# Altium project stabilizer_current_sense.PrjPCB (part 1 of 2)
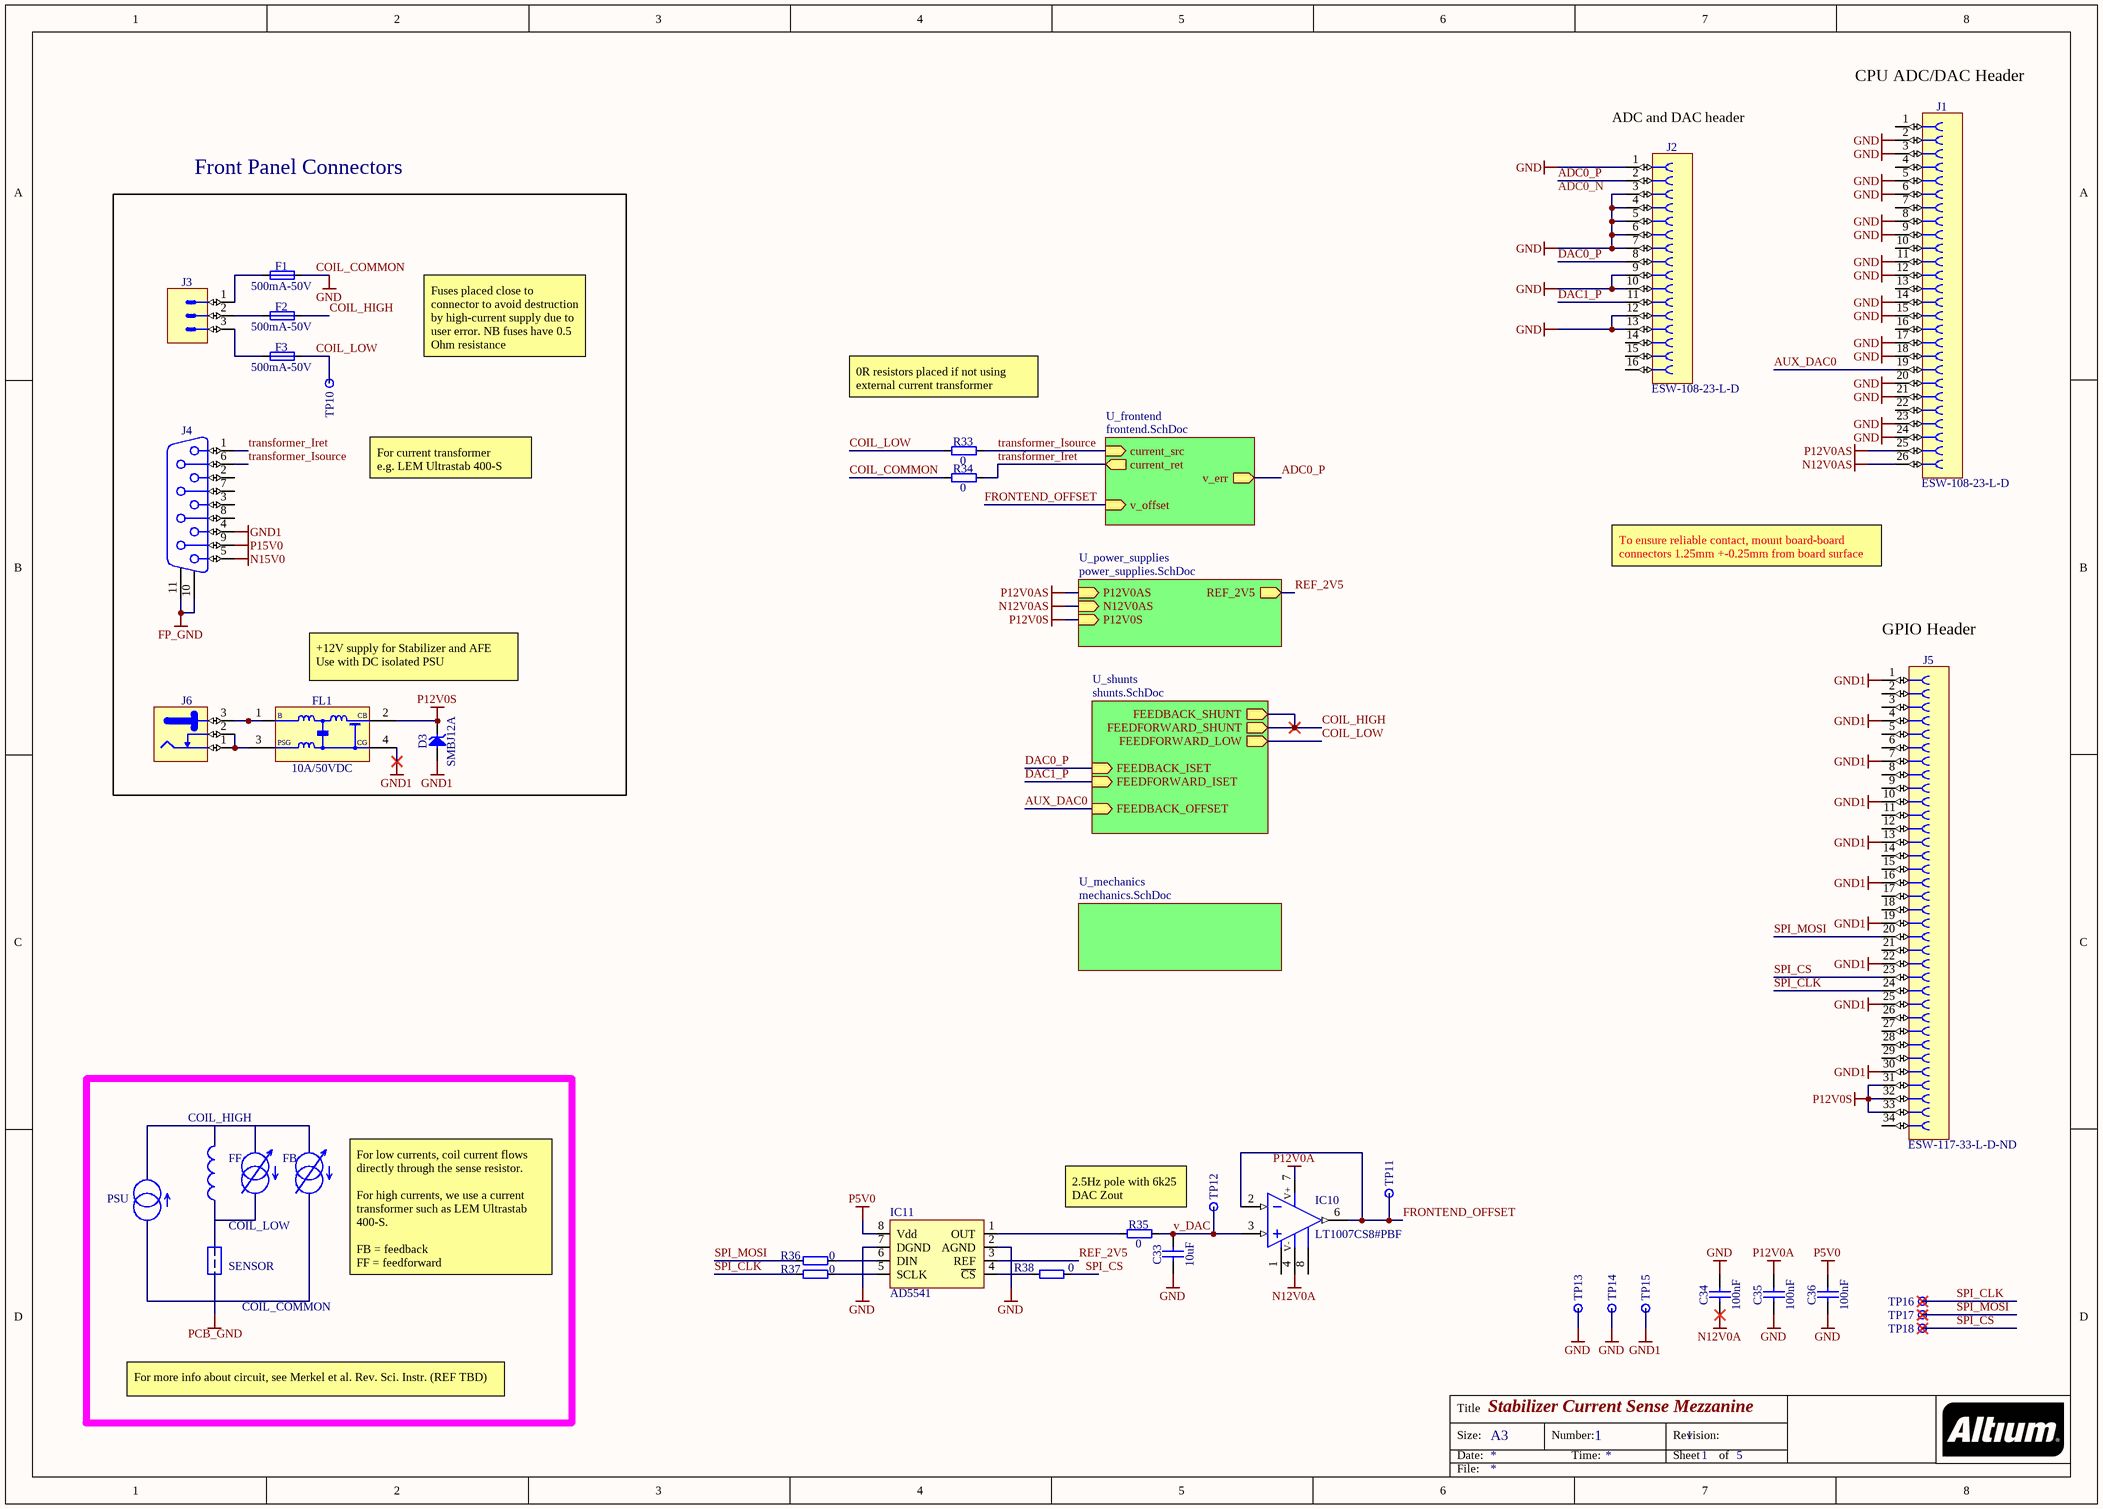
[diagram p0: stabilizer_current_sense.SchDoc]
ProjAddress1: Department of Physics; ProjAddress2: University of Oxford; ProjAddress3: UK; ProjOrganization: Ion Trapping Group; ProjRevision: 1.0
5 sheets, 206 parts. Net scope: hierarchical (ports join the sheet entries above them; power ports are global).
Board file: stabilizer_current_sense.PcbDoc
Sheets:
  stabilizer_current_sense.SchDoc
    U_power_supplies = power_supplies.SchDoc
    U_mechanics = mechanics.SchDoc
    U_frontend = frontend.SchDoc
    U_shunts = shunts.SchDoc

## Sheet stabilizer_current_sense.SchDoc: Stabilizer Current Sense Mezzanine
size A3; Organization: Ion Trapping Group; Address1: Department of Physics; Address2: University of Oxford; Address3: UK; DocumentNumber: 1; Revision: 1.0; SheetNumber: 1; SheetTotal: 5

### Parts
C33  10uF  [CAPC2012X95N]
C34  100nF  [CAPC1608X87N]
C35  100nF  [CAPC1608X87N]
C36  100nF  [CAPC1608X87N]
D3  SMBJ12A  [DIOM5336X265N]
F1  500mA-50V  [FUSC1608X55N]
F2  500mA-50V  [FUSC1608X55N]
F3  500mA-50V  [FUSC1608X55N]
FL1  10A/50VDC  [FIL_MURATA_BNX02]
IC10  LT1007CS8#PBF  [SOIC127P600X175-8N]
IC11  AD5541  [so-8]
J1  ESW-108-23-L-D  [ESW-113-23-L-D]
J2  ESW-108-23-L-D  [ESW-108-23-L-D]
J3  MSTBA  [PHOENIX_1757255]  (value not drawn)
J4  D-Sub 9F  [FCI_D09S13A4GV00LF]  (value not drawn)
J5  Manufacturer Part Number: ESW-117-33-L-D-ND  [ESW-117-23-L-D]  (hidden comment: ESW-108-23-L-D)
J6  Jack  [SWITCHCRAFT_L712RA]  (value not drawn)
R33  0  [RESC1608X55N]
R34  0  [RESC1608X55N]
R35  0  [RESC1608X55N]
R36  0  [RESC1608X55N]
R37  0  [RESC1608X55N]
R38  0  [RESC1608X55N]
TP10  Test Point  [TPS127]  (value not drawn)
TP11  Test Point  [TPS127]  (value not drawn)
TP12  Test Point  [TPS127]  (value not drawn)
TP13  Test Point  [TPS127]  (value not drawn)
TP14  Test Point  [TPS127]  (value not drawn)
TP15  Test Point  [TPS127]  (value not drawn)
TP16  Test Point  [TPS127]  (value not drawn)
TP17  Test Point  [TPS127]  (value not drawn)
TP18  Test Point  [TPS127]  (value not drawn)

### Blocks framed on the sheet
Front Panel Connectors: D3 F1-F3 FL1 J3 J4 J6 TP10

### Sub-sheets
U_frontend = frontend.SchDoc: current_src (in), current_ret (out), v_err (out), v_offset (in)
U_mechanics = mechanics.SchDoc: no entries
U_power_supplies = power_supplies.SchDoc: REF_2V5 (out), P12V0AS (in), N12V0AS (in), P12V0S (in)
U_shunts = shunts.SchDoc: FEEDBACK_OFFSET (in), FEEDBACK_ISET (in), FEEDFORWARD_ISET (in), FEEDBACK_SHUNT (out), FEEDFORWARD_SHUNT (out), FEEDFORWARD_LOW (out)

### Nets
COIL_COMMON: C33.1 C34.2 C35.1 C36.1 F1.1 IC11.2(AGND) IC11.7(DGND) J1.2 J1.3 J1.5 J1.6 J1.8 J1.9 J1.11 J1.12 J1.14 J1.15 J1.17 J1.18 J1.20 J1.21 J1.23 J1.24 J2.1 J2.3 J2.4 J2.5 J2.6 J2.7 J2.9 J2.10 J2.12 J2.13 R34.1 TP13.1 TP14.1  [also labelled GND]
FP_GND: J4.10 J4.11
GND1: D3.2(A) FL1.4(CG) J4.4 J5.1 J5.4 J5.7 J5.10 J5.13 J5.16 J5.19 J5.22 J5.25 J5.30 TP15.1
N12V0A: C34.1 IC10.4(V-)
N12V0AS: J1.26 ; sheet U_power_supplies/N12V0AS
N15V0: J4.5
P5V0: C36.2 IC11.8(Vdd)
P12V0A: C35.2 IC10.7(V+)
P12V0AS: J1.25 ; sheet U_power_supplies/P12V0AS
P12V0S: D3.1(C) FL1.2(CB) J5.31 J5.32 J5.33 ; sheet U_power_supplies/P12V0S
P15V0: J4.9
ADC0_P: J2.2 ; sheet U_frontend/v_err
AUX_DAC0: J1.19 ; sheet U_shunts/FEEDBACK_OFFSET
COIL_HIGH: F2.1 ; sheet U_shunts/FEEDBACK_SHUNT, sheet U_shunts/FEEDFORWARD_SHUNT
COIL_LOW: F3.1 R33.1 TP10.1 ; sheet U_shunts/FEEDFORWARD_LOW
DAC0_P: J2.8 ; sheet U_shunts/FEEDBACK_ISET
DAC1_P: J2.11 ; sheet U_shunts/FEEDFORWARD_ISET
FRONTEND_OFFSET: IC10.2(IN-) IC10.6(OUT) TP11.1 ; sheet U_frontend/v_offset
REF_2V5: IC11.3(REF) ; sheet U_power_supplies/REF_2V5
SPI_CLK: J5.24 R37.1 TP16.1
SPI_CS: J5.23 R38.2 TP18.1
SPI_MOSI: J5.20 R36.1 TP17.1
transformer_Iret: J4.1 R34.2 ; sheet U_frontend/current_ret
transformer_Isource: J4.6 R33.2 ; sheet U_frontend/current_src
v_DAC: C33.2 IC10.3(IN+) R35.2 TP12.1
NetF1_2: F1.2 J3.1
NetF2_2: F2.2 J3.2
NetF3_2: F3.2 J3.3
NetFL1_1: FL1.1(B) J6.3
NetFL1_3: FL1.3(PSG) J6.1 J6.2
NetIC11_1: IC11.1(OUT) R35.1
NetIC11_4: IC11.4(~{CS}) R38.1
NetIC11_5: IC11.5(SCLK) R37.2
NetIC11_6: IC11.6(DIN) R36.2

Not connected (* = marked no-connect by the designer): IC10 1(OFFSET) 8(OFFSET); J1 1 4 7 10 13 16 22; J2 14 15 16; J4 2 3 7 8; J5 2 3 5 6 8 9 11 12 14 15 17 18 21 26 27 28 29 34

### Notes on the sheet
- (near J1) CPU ADC/DAC Header
- (near J2) ADC and DAC header
- ADC0_N
- Fuses placed close to connector to avoid destruction by high-current supply due to user error. NB fuses have 0.5 Ohm resistance
- 0R resistors placed if not using external current transformer
- For current transformer
  e.g. LEM Ultrastab 400-S
- To ensure reliable contact, mount board-board connectors 1.25mm +-0.25mm from board surface
- (near J5) GPIO Header
- +12V supply for Stabilizer and AFE
  Use with DC isolated PSU
- COIL_HIGH
- FF
- FB
- PSU
- COIL_LOW
- 2.5Hz pole with 6k25 DAC Zout
- SENSOR
- COIL_COMMON
- For low currents, coil current flows directly through the sense resistor.
  For high currents, we use a current transformer such as LEM Ultrastab 400-S.
  FB = feedback
  FF = feedforward
- For more info about circuit, see Merkel et al. Rev. Sci. Instr. (REF TBD)
- PCB_GND
- Title
- Size:
- Date:
- A3
- Number:
- Time:
- Revision:
- Sheet
- of
- File:

### Library data of the parts
C33 = CC0805_10UF_25V_10%_X5R: Non-polarised capacitor; Part Description: SMD Multilayer Chip Ceramic Capacitor; Manufacturer: GENERIC; Manufacturer1 Part Number: GRM219R61E106KA12D; Voltage: 25V; TC: X5R; Tolerance: ±10%; Part Number: CC0805_10UF_25V_10%_X5R; Component Kind: Standard; Component Type: Standard; Pin Count: 2; Value: 10uF; Status: Preferred; Manufacturer Part Number: CC0805_10UF_25V_10%_X5R; Case: 0805; Mounted: Yes; Socket: No; SMD: Yes; Sense: No; Manufacturer1 Example: MURATA; Manufacturer1 ComponentHeight: 0.95mm; HelpURL: \\cern.ch\dfs\Applications\Altium\Datasheets\CC0805_X5R_MURATA_GRM.pdf; Author: CERN DEM JLC; CreateDate: 25/10/2012; LatestRevisionDate: 06/09/2016
C34-C36 = CC0603_100NF_50V_10%_X7R: Non-polarised capacitor; Part Description: SMD Multilayer Chip Ceramic Capacitor; Manufacturer: GENERIC; Manufacturer1 Part Number: 223858615649; Voltage: 50V; TC: X7R; Tolerance: ±10%; Part Number: CC0603_100NF_50V_10%_X7R; Component Kind: Standard; Component Type: Standard; Pin Count: 2; Value: 100nF; Status: Preferred; Manufacturer Part Number: CC0603_100NF_50V_10%_X7R; Case: 0603; Mounted: Yes; Socket: No; SMD: Yes; Sense: No; Manufacturer1 Example: PHYCOMP; Manufacturer1 ComponentHeight: 0.87mm; HelpURL: \\cern.ch\dfs\Applications\Altium\Datasheets\CC0603_X7R_PHYCOMP.pdf; Author: CERN DEM JLC; CreateDate: 03/12/2007; LatestRevisionDate: 03/12/2007
D3 = SMBJ12A: Zener Diode; Part Description: Uni-Directional Transient Voltage Suppressor Diode; Manufacturer: FAIRCHILD SEMICONDUCTOR; Voltage: 12V; Power: 600W; PressFit: No; Bonding: No; Part Number: SMBJ12A; Component Kind: Standard; Component Type: Standard; Device: SMBJ12A; PackageDescription: DO-214-AA/SMB Diode, Molded Body; 5.34mm L X 3.625mm W X 2.65mm H, IPC Medium Density; Manufacturer Part Number: SMBJ12A; Pin Count: 2; Case: DO-214AA; Mounted: Yes; Socket: No; SMD: Yes; Sense: No; ComponentHeight: 2.65mm; HelpURL: \\cern.ch\dfs\Applications\Altium\Datasheets\SMBJ.pdf; Author: CERN DEM JLC; CreateDate: 10/04/2013; LatestRevisionDate: 10/04/2013
F1-F3 = FUS0603_BOURNS-SF-0603F050-2: Fuse; Part Description: Thin Film Chip Fuse; Manufacturer: BOURNS; PressFit: No; Part Number: FUS0603_BOURNS-SF-0603F050-2; Component Kind: Standard; Component Type: Standard; Pin Count: 2; PackageDescription: Chip Fuse, 2-Leads, Body 1.6mm x 0.8mm, IPC Medium Density; Family: Fuse; Mounted: Yes; Socket: No; SMD: Yes; Sense: No; Value: 500mA-50V; Manufacturer Part Number: SF-0603F050-2; ComponentHeight: 0.55mm; HelpURL: \\cern.ch\dfs\Applications\Altium\Datasheets\FUSE_BOURNS_SF-0603F.pdf; Author: CERN DEM JLC; CreateDate: 01/02/2017; LatestRevisionDate: 01/02/2017
FL1 = FIL_MURATA_BNX022-01L: Block Type EMIFIL (LC Combined); Part Description: Block Type EMIFIL (LC Combined) SMD Type, BNX02* Series; Manufacturer: MURATA; Resistance: 0.5R; Part Number: FIL_MURATA_BNX022-01L; Component Kind: Standard; Component Type: Standard; Pin Count: 2; Value: 10A/50VDC; Status: None; Manufacturer Part Number: BNX022-01L; Mounted: Yes; Socket: No; SMD: Yes; Sense: No; ComponentHeight: 3.3mm; HelpURL: \\cern.ch\dfs\Applications\Altium\Datasheets\FIL_MURATA_BNX022-01L.pdf; Author: CERN DEM JLC; CreateDate: 10/10/2012; LatestRevisionDate: 10/10/2012
IC10 = LT1007CS8#PBF: Operational Amplifier with Offset 1-8; Part Description: Low Noise, High Speed Precision Operational Amplifier; Manufacturer: LINEAR TECHNOLOGY; PressFit: No; Bonding: No; Part Number: LT1007CS8#PBF; Component Kind: Standard; Component Type: Standard; Device: LT1007CS8#PBF; PackageDescription: SOIC 8, Pitch 1.27mm - Body 4x5mm, IPC Medium Density; Manufacturer Part Number: LT1007CS8#PBF; Pin Count: 7; Case: SOIC8; Mounted: Yes; Socket: No; SMD: Yes; Sense: No; ComponentHeight: 1.75mm; Author: CERN DEM JLC; HelpURL: \\cern.ch\dfs\Applications\Altium\Datasheets\LT1007CS8#PBF.pdf; CreateDate: 09/03/2011; LatestRevisionDate: 09/03/2011
IC11 = AD5541LRZ: 16 bit serial DAC; Manufacturer: ANALOG DEVICES; Manufacturer Part Number: AD5541LRZ
J1 = ESW-113-23-L-D: Connector Elevated Socket 26 POS 2.54mm, 13.59mm height; Manufacturer: Samtec; Manufacturer Part Number: ESW-108-23-L-D
J2 = ESW-108-23-L-D: Connector Elevated Socket 16 POS 2.54mm, 13.59mm height; Manufacturer: Samtec; Manufacturer Part Number: ESW-108-23-L-D
J3 = PHOENIX_1757255: Connector 3 Male; Part Description: 12A, 250V, Pitch 5.08mm, 3 Positions Header; Manufacturer: PHOENIX CONTACT; Manufacturer Part Number: 1757255 (MSTBA 2,5/ 3-G-5,08); PressFit: No; Part Number: PHOENIX_1757255; Component Kind: Standard; Component Type: Standard; Pin Count: 3; Mounted: Yes; Socket: No; SMD: No; Sense: No; Status: None; ComponentHeight: 8.6mm; HelpURL: \\cern.ch\dfs\Applications\Altium\Datasheets\PHOENIX_1757255.pdf; Author: CERN DEM JLC; CreateDate: 10/02/2010; LatestRevisionDate: 26/04/2010; Family: MSTBA
J4 = FCI_D09S13A4GV00LF: Connector D-sub 9 Female; Part Description: Right Angled D-SUB 9 Female Contacts for PCB  with Harpoons and Female Screwlock (UNC4-40) and Elec. Continuity; Manufacturer: FCI; PressFit: No; Part Number: FCI_D09S13A4GV00LF; Component Kind: Standard; Component Type: Standard; Pin Count: 11; Family: D-Sub 9F; Mounted: Yes; Socket: No; SMD: No; Sense: No; Status: None; Manufacturer Part Number: D09S13A4GV00LF; ComponentHeight: 13.86mm; HelpURL: \\cern.ch\dfs\Applications\Altium\Datasheets\FCI_D09S13A4GV00LF.pdf; Author: CERN DEM JLC; CreateDate: 04/10/2017; LatestRevisionDate: 04/10/2017
J5 = ESW-117-23-L-D: Connector Elevated Socket 34 POS 2.54mm, 13.59mm height; Manufacturer: Samtec
J6 = SWITCHCRAFT_L712RA: 24V /3. 5A, 2.1mm Diameter Pin, SMD DC Power Supply Connector With  Break Contact; Part Description: 12V/5A, 2.5mm Diameter Pin, THT DC Power Supply Connector With  Break Contact; Manufacturer Part Number: L712RA; PressFit: No; Part Number: SWITCHCRAFT_L712RA; Component Kind: Standard; Component Type: Standard; Pin Count: 3; Family: Jack; Mounted: Yes; Socket: No; SMD: No; Sense: No; Status: None; Manufacturer: SWITCHCRAFT; ComponentHeight: 11mm; HelpURL: \\cern.ch\dfs\Applications\Altium\Datasheets\LUMBERG_161314.pdf; Author: GK; CreateDate: 15.02.2011; LatestRevisionDate: 20.07.2011
R33-R38 = R0603_0R_JUMPER: Resistor; Part Description: 1A (0.05R Max DC Resistance) Zero Ohm Jumper; Manufacturer: GENERIC; Manufacturer1 Part Number: NRC06Z0; PressFit: No; Part Number: R0603_0R_JUMPER; Component Kind: Standard; Component Type: Standard; Pin Count: 2; Value: 0; Status: Preferred; Manufacturer Part Number: R0603_0R_JUMPER; Case: 0603; Mounted: Yes; Sense: No; Socket: No; SMD: Yes; Manufacturer1 Example: NIC COMPONENT; Manufacturer1 ComponentHeight: 0.55mm; HelpURL: \\cern.ch\dfs\Applications\Altium\Datasheets\R0603_NIC_NRC.pdf; Author: CERN DEM JLC; CreateDate: 03/12/2007; LatestRevisionDate: 13/03/2008
TP10-TP18 = SMD_PAD_1.27X1.27MM: Part Description: 1.27mm x 1.27mm PCB Copper Area (SMD Test Point); Mounted: No; Part Number: SMD_PAD_1.27X1.27MM; Component Kind: Standard (No BOM); Component Type: Standard (No BOM); Pin Count: 1; Family: Test Point; Socket: No; SMD: Yes; Sense: No; Status: None; ComponentHeight: 0mm; HelpURL: Undefined; Author: CERN DEM JLC; CreateDate: 12/01/2008; LatestRevisionDate: 12/01/2008; PackageDescription: 1.27mm x 1.27mm PCB Copper Area (SMD Test Point)

## Sheet power_supplies.SchDoc: Supplies
size A3; Organization: Ion Trapping Group; Address1: Department of Physics; Address2: University of Oxford; Address3: UK; DocumentNumber: 1; Revision: 1.0; SheetNumber: 4; SheetTotal: 5
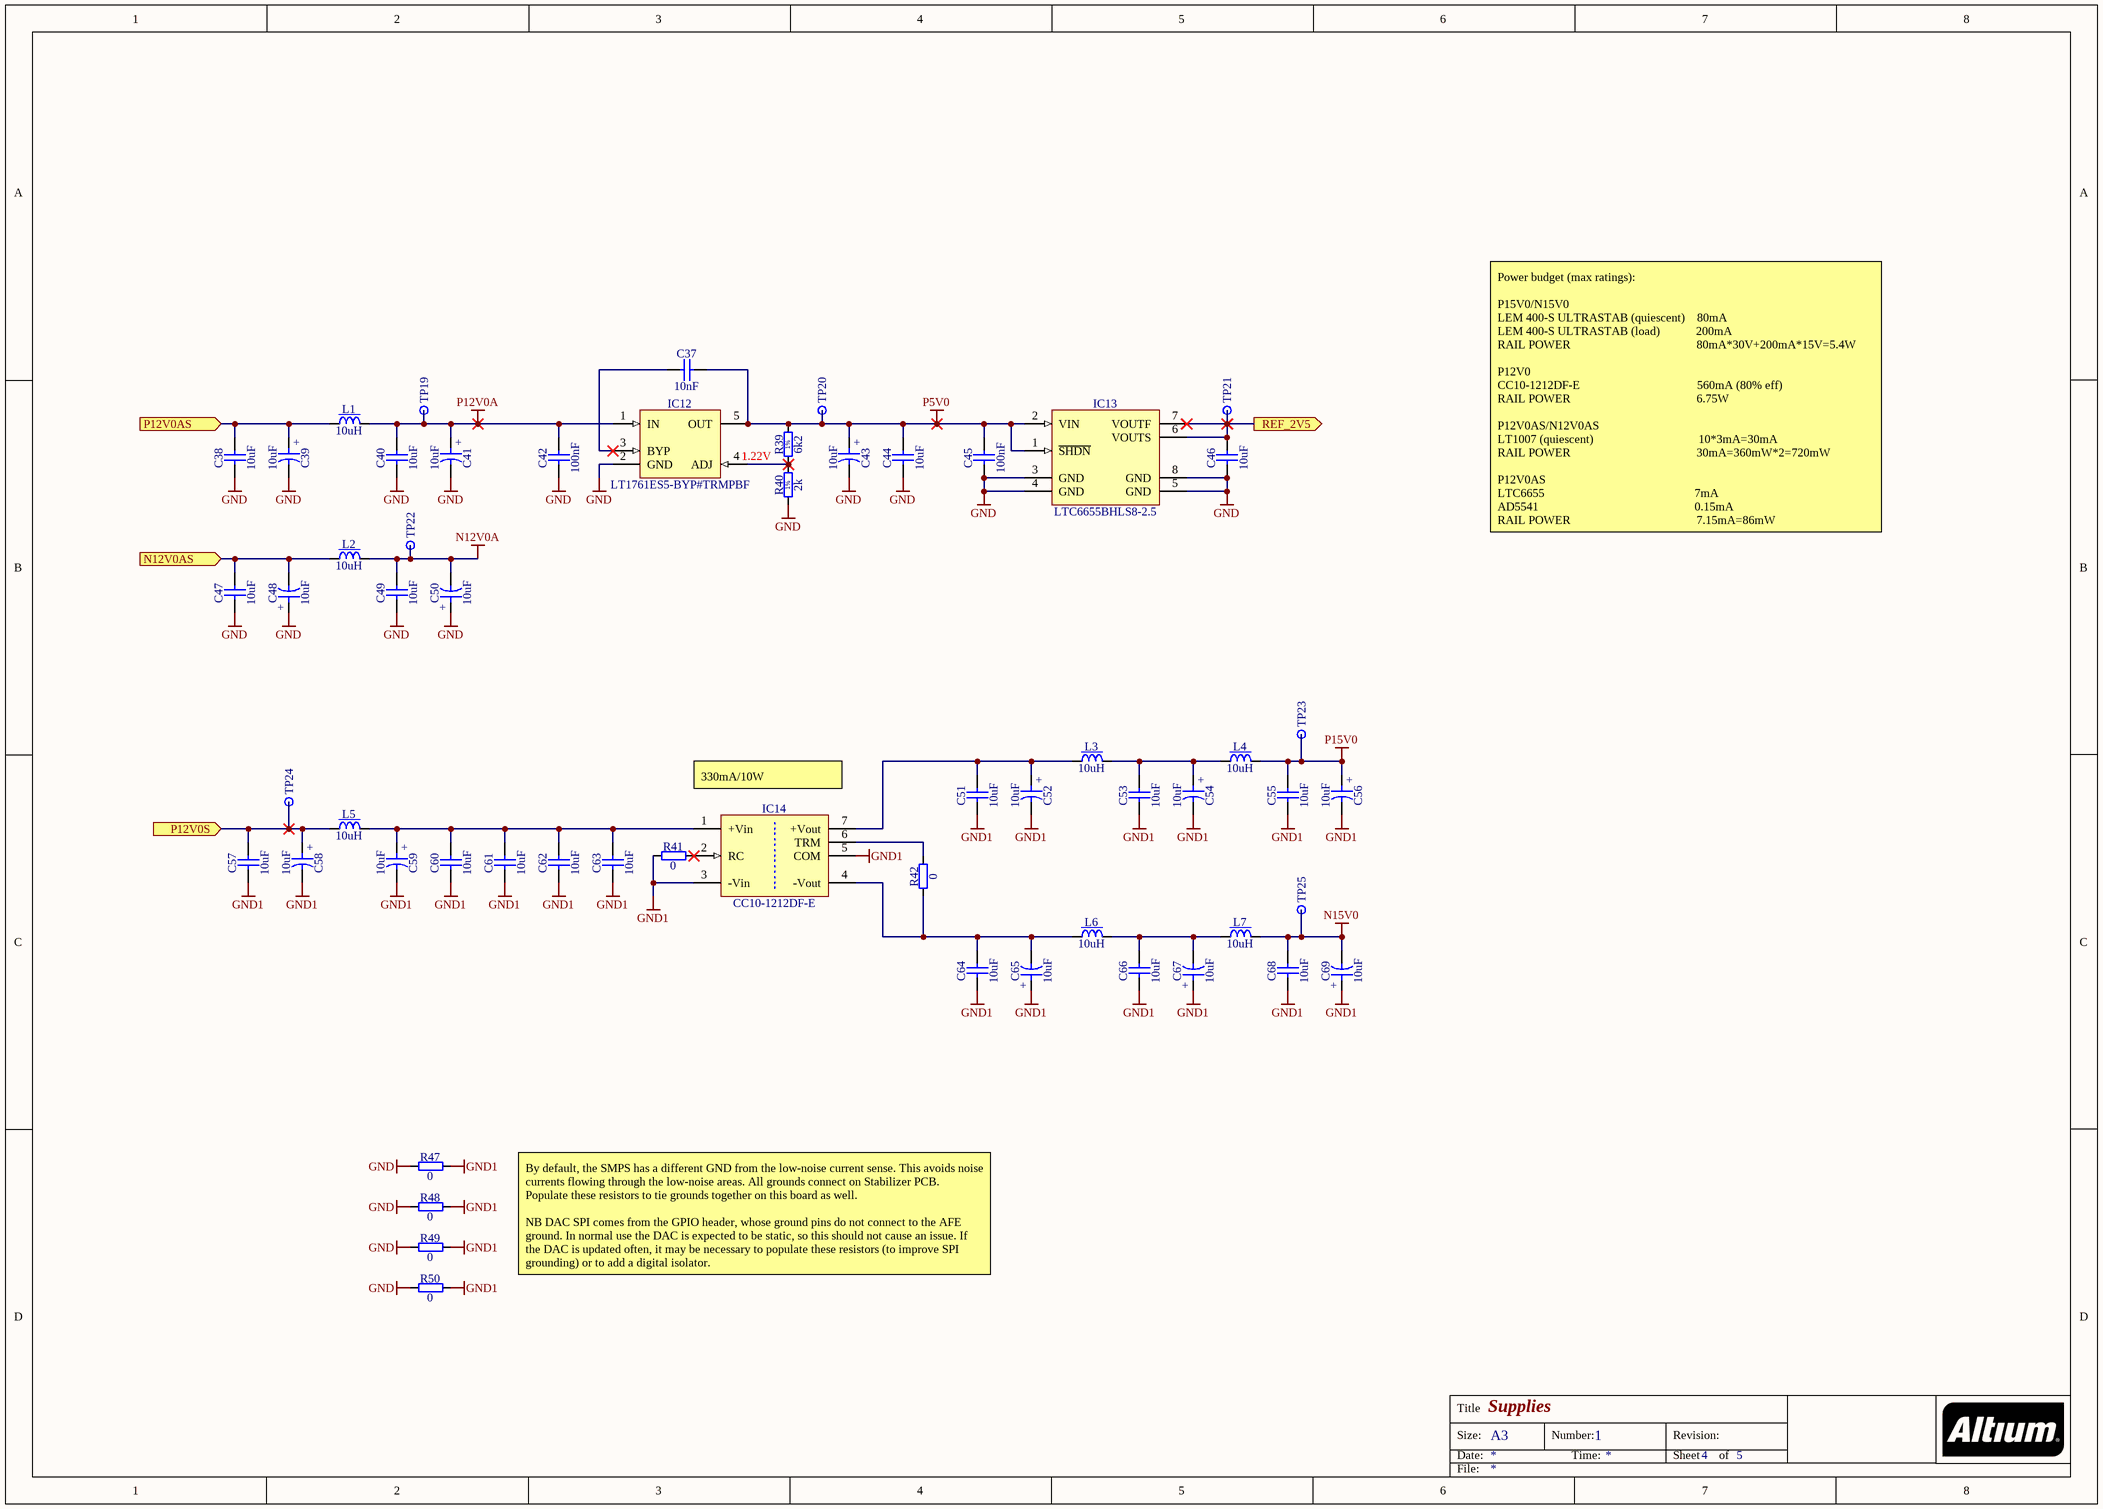
[diagram p1: power_supplies.SchDoc]

### Parts
C37  10nF  [CAPC1608X87N]
C38  10uF  [CAPC2012X95N]
C39  10uF  [CAPMP6032X280N]
C40  10uF  [CAPC2012X95N]
C41  10uF  [CAPMP6032X280N]
C42  100nF  [CAPC1608X87N]
C43  10uF  [CAPMP6032X280N]
C44  10uF  [CAPC2012X95N]
C45  100nF  [CAPC1608X87N]
C46  10uF  [CAPC2012X95N]
C47  10uF  [CAPC2012X95N]
C48  10uF  [CAPMP6032X280N]
C49  10uF  [CAPC2012X95N]
C50  10uF  [CAPMP6032X280N]
C51  10uF  [CAPC2012X95N]
C52  10uF  [CAPMP6032X280N]
C53  10uF  [CAPC2012X95N]
C54  10uF  [CAPMP6032X280N]
C55  10uF  [CAPC2012X95N]
C56  10uF  [CAPMP6032X280N]
C57  10uF  [CAPC2012X95N]
C58  10uF  [CAPMP6032X280N]
C59  10uF  [CAPMP6032X280N]
C60  10uF  [CAPC2012X95N]
C61  10uF  [CAPC2012X95N]
C62  10uF  [CAPC2012X95N]
C63  10uF  [CAPC2012X95N]
C64  10uF  [CAPC2012X95N]
C65  10uF  [CAPMP6032X280N]
C66  10uF  [CAPC2012X95N]
C67  10uF  [CAPMP6032X280N]
C68  10uF  [CAPC2012X95N]
C69  10uF  [CAPMP6032X280N]
IC12  LT1761ES5-BYP#TRMPBF  [SOT95P280X100-5N]
IC13  LTC6655BHLS8-2.5  [LT_LS8]
IC14  CC10-1212DF-E  [CC10-1212DF-E]
L1  10uH  [IND_MURATA-PS_8400]
L2  10uH  [IND_MURATA-PS_8400]
L3  10uH  [IND_MURATA-PS_8400]
L4  10uH  [IND_MURATA-PS_8400]
L5  10uH  [IND_MURATA-PS_8400]
L6  10uH  [IND_MURATA-PS_8400]
L7  10uH  [IND_MURATA-PS_8400]
R39  6k2  [RESC1608X55N]
R40  2k  [RESC1608X55N]
R41  0  [RESC1608X55N]
R42  0  [RESC1608X55N]
R47  0  [RESC1608X55N]
R48  0  [RESC1608X55N]
R49  0  [RESC1608X55N]
R50  0  [RESC1608X55N]
TP19  Test Point  [TPS127]  (value not drawn)
TP20  Test Point  [TPS127]  (value not drawn)
TP21  Test Point  [TPS127]  (value not drawn)
TP22  Test Point  [TPS127]  (value not drawn)
TP23  Test Point  [TPS127]  (value not drawn)
TP24  Test Point  [TPS127]  (value not drawn)
TP25  Test Point  [TPS127]  (value not drawn)

### Ports
N12V0AS (in), P12V0AS (in), P12V0S (in), REF_2V5 (out)

### Nets
GND: C38.1 C39.2 C40.1 C41.2 C42.1 C43.2 C44.1 C45.1 C46.1 C47.1 C48.1 C49.1 C50.1 IC12.2(GND) IC13.3(GND) IC13.4(GND) IC13.5(GND) IC13.8(GND) R40.1 R47.1 R48.1 R49.1 R50.1  [project net COIL_COMMON]
GND1: C51.1 C52.2 C53.1 C54.2 C55.1 C56.2 C57.1 C58.2 C59.2 C60.1 C61.1 C62.1 C63.1 C64.1 C65.1 C66.1 C67.1 C68.1 C69.1 IC14.3(-Vin) IC14.5(COM) R41.1 R47.2 R48.2 R49.2 R50.2
N12V0A: C49.2 C50.2 L2.2 TP22.1
N12V0AS: C47.2 C48.2 L2.1 ; port N12V0AS
N15V0: C68.2 C69.2 L7.2 TP25.1
P5V0: C37.2 C43.1 C44.2 C45.2 IC12.5(OUT) IC13.1(~{SHDN}) IC13.2(VIN) R39.2 TP20.1
P12V0A: C40.2 C41.1 C42.2 IC12.1(IN) L1.2 TP19.1
P12V0AS: C38.2 C39.1 L1.1 ; port P12V0AS
P12V0S: C57.2 C58.1 L5.1 TP24.1 ; port P12V0S
P15V0: C55.2 C56.1 L4.2 TP23.1
REF_2V5: C46.2 IC13.6(VOUTS) IC13.7(VOUTF) TP21.1 ; port REF_2V5
NetC37_1: C37.1 IC12.3(BYP)
NetC51_2: C51.2 C52.1 IC14.7(+Vout) L3.1
NetC53_2: C53.2 C54.1 L3.2 L4.1
NetC59_1: C59.1 C60.2 C61.2 C62.2 C63.2 IC14.1(+Vin) L5.2
NetC64_2: C64.2 C65.2 IC14.4(-Vout) L6.1 R42.1
NetC66_2: C66.2 C67.2 L6.2 L7.1
NetIC12_4: IC12.4(ADJ) R39.1 R40.2
NetIC14_2: IC14.2(RC) R41.2
NetIC14_6: IC14.6(TRM) R42.2

### Notes on the sheet
- 1.22V
- Power budget (max ratings):
  P15V0/N15V0
  LEM 400-S ULTRASTAB (quiescent)    80mA
  LEM 400-S ULTRASTAB (load)            200mA
  RAIL POWER                                          80mA*30V+200mA*15V=5.4W
  P12V0
  CC10-1212DF-E                                       560mA (80% eff)
  RAIL POWER                                          6.75W
  P12V0AS/N12V0AS
  LT1007 (quiescent)                                   10*3mA=30mA
  RAIL POWER                                          30mA=360mW*2=720mW
  P12V0AS
  LTC6655                                                  7mA
  AD5541                                                    0.15mA
  RAIL POWER                                          7.15mA=86mW
- (near IC14) 330mA/10W
- By default, the SMPS has a different GND from the low-noise current sense. This avoids noise currents flowing through the low-noise areas. All grounds connect on Stabilizer PCB. Populate these resistors to tie grounds together on this board as well.
  NB DAC SPI comes from the GPIO header, whose ground pins do not connect to the AFE ground. In normal use the DAC is expected to be static, so this should not cause an issue. If the DAC is updated often, it may be necessary to populate these resistors (to improve SPI grounding) or to add a digital isolator.
- Title
- Size:
- Date:
- A3
- Number:
- Time:
- Revision:
- Sheet
- of
- File:
- (in symbol CTE6032-28_10UF_25V_10%_LESR0500) +
- (in symbol R0603_2K_1%_0.1W_100PPM) 1%
- (in symbol R0603_6K2_1%_0.1W_100PPM) 1%

### Library data of the parts
C37 = CC0603_10NF_50V_10%_X7R: Non-polarised capacitor; Part Description: SMD Multilayer Chip Ceramic Capacitor; Manufacturer: GENERIC; Manufacturer1 Part Number: 223858615636; Voltage: 50V; TC: X7R; Tolerance: ±10%; Part Number: CC0603_10NF_50V_10%_X7R; Component Kind: Standard; Component Type: Standard; Pin Count: 2; Value: 10nF; Status: Preferred; Manufacturer Part Number: CC0603_10NF_50V_10%_X7R; Case: 0603; Mounted: Yes; Socket: No; SMD: Yes; Sense: No; Manufacturer1 Example: PHYCOMP; Manufacturer1 ComponentHeight: 0.87mm; HelpURL: \\cern.ch\dfs\Applications\Altium\Datasheets\CC0603_X7R_PHYCOMP.pdf; Author: CERN DEM JLC; CreateDate: 03/12/2007; LatestRevisionDate: 03/12/2007
C38 C40 C44 C46 C47 C49 C51 C53 C55 C57 C60-C64 C66 C68 = CC0805_10UF_25V_10%_X5R: as C33 on sheet stabilizer_current_sense; Part Number: CC0805_10UF_25V_10%_X5R; Component Kind: Standard; Component Type: Standard; Pin Count: 2; Value: 10uF; Status: Preferred; Manufacturer Part Number: CC0805_10UF_25V_10%_X5R; Case: 0805; Mounted: Yes; Socket: No; SMD: Yes; Sense: No; Manufacturer1 Example: MURATA; Manufacturer1 ComponentHeight: 0.95mm; HelpURL: \\cern.ch\dfs\Applications\Altium\Datasheets\CC0805_X5R_MURATA_GRM.pdf; Author: CERN DEM JLC; CreateDate: 25/10/2012; LatestRevisionDate: 06/09/2016
C39 C41 C43 C48 C50 C52 C54 C56 C58 C59 C65 C67 C69 = CTE6032-28_10UF_25V_10%_LESR0500: Polarised capacitor; Part Description: Low ESR 0R5 Solid Tantalum Chip Capacitor; Manufacturer: GENERIC; Manufacturer1 Part Number: TPSC106K025R0500; Voltage: 25V; Tolerance: ±10%; Part Number: CTE6032-28_10UF_25V_10%_LESR0500; Component Kind: Standard; Component Type: Standard; Pin Count: 2; Value: 10uF; Status: Preferred; Manufacturer Part Number: CTE6032-28_10UF_25V_10%_LESR0500; Case: C; Mounted: Yes; Socket: No; SMD: Yes; Sense: No; Manufacturer1 Example: AVX; Manufacturer1 ComponentHeight: 2.8mm; HelpURL: \\cern.ch\dfs\Applications\Altium\Datasheets\CTE-LESR_AVX_TPS.pdf; Author: CERN DEM JLC; CreateDate: 05/05/2008; LatestRevisionDate: 20/01/2009
C42 C45 = CC0603_100NF_50V_10%_X7R: as C34 on sheet stabilizer_current_sense; Part Number: CC0603_100NF_50V_10%_X7R; Component Kind: Standard; Component Type: Standard; Pin Count: 2; Value: 100nF; Status: Preferred; Manufacturer Part Number: CC0603_100NF_50V_10%_X7R; Case: 0603; Mounted: Yes; Socket: No; SMD: Yes; Sense: No; Manufacturer1 Example: PHYCOMP; Manufacturer1 ComponentHeight: 0.87mm; HelpURL: \\cern.ch\dfs\Applications\Altium\Datasheets\CC0603_X7R_PHYCOMP.pdf; Author: CERN DEM JLC; CreateDate: 03/12/2007; LatestRevisionDate: 03/12/2007
IC12 = LT1761ES5-BYP#TRMPBF: 100mA, Low Noise, LDO Micropower Adjustable Regulator in SOT-23; Part Description: 1.22V to 20V, 100mA, Low Noise, LDO Adjustable Micropower Regulator; Manufacturer: LINEAR TECHNOLOGY; PressFit: No; Bonding: No; Part Number: LT1761ES5-BYP#TRMPBF; Component Kind: Standard; Component Type: Standard; Device: LT1761ES5-BYP#TRMPBF; PackageDescription: SOT23, 0.95mm pitch; 5 pin, 1.6mm W X 2.9mm L, IPC Medium Density; Manufacturer Part Number: LT1761ES5-BYP#TRMPBF; Pin Count: 5; Case: SOT23; Mounted: Yes; Socket: No; SMD: Yes; Sense: No; ComponentHeight: 1mm; HelpURL: \\cern.ch\dfs\Applications\Altium\Datasheets\LT1761ES5-SD#TRMPBF.pdf; Author: CERN DEM MR; CreateDate: 17/02/2016; LatestRevisionDate: 17/02/2016
IC13 = LTC6655BHLS8-2.5#PBF: 2.5V, 0.25ppm Noise, Low Drift Precision Buffered Voltage Reference; Manufacturer: ANALOG DEVICES; Supplier 1: Digi-Key; Manufacturer Part Number: LTC6655BHLS8-2.5#PBF; Device: LTC6655BHLS8-2.5
IC14 = CC10-1212DF-E: CONV DC/DC 10W DUAL 12V +-12V PCB; Manufacturer: TDK-Lambda Americas Inc.; PressFit: No; Bonding: No; Part Number: CC10-1212DF-E; Component Kind: Standard; Component Type: Standard; Device: CC10-1212DF-E; PackageDescription: CC10 Series, Body 1.400 x 0.890 x 0.335, Regulated; Part Description: CONV DC/DC 10W DUAL 12V +-12V PCB; Manufacturer Part Number: CC10-1212DF-E; Pin Count: 7; Mounted: Yes; Socket: No; SMD: No; Sense: No; ComponentHeight: 8.5; Author: TPH; CreateDate: 14.03.2019; LatestRevisionDate: 14.03.2019
L1-L7 = IND_10UH_10%_MURATA-PS_8400: Inductor With Core; Part Description: Miniature Surface Mount Power Inductor (8400 Serie); Manufacturer: MURATA POWER SOLUTIONS; Manufacturer Part Number: 84103C; Power: 950mA; Resistance: 0.24R; Tolerance: ±10%; Part Number: IND_10UH_10%_MURATA-PS_8400; Component Kind: Standard; Component Type: Standard; Pin Count: 2; Value: 10uH; Status: None; Mounted: Yes; Socket: No; SMD: Yes; Sense: No; ComponentHeight: 2.9mm; HelpURL: \\cern.ch\dfs\Applications\Altium\Datasheets\IND_MURATA-PS_8400.pdf; Author: CERN DEM JLC; CreateDate: 02.07.2012; LatestRevisionDate: 02.07.2012
R39 = R0603_6K2_1%_0.1W_100PPM: Resistor - 1%; Part Description: General Purpose Thick Film Chip Resistor; Manufacturer: GENERIC; Manufacturer1 Part Number: NRC06F6201TRF; Power: 0.1W; TC: ±100ppm/°C; PressFit: No; Part Number: R0603_6K2_1%_0.1W_100PPM; Component Kind: Standard; Component Type: Standard; Pin Count: 2; Value: 6k2; Status: Preferred; Tolerance: ±1%; Manufacturer Part Number: R0603_6K2_1%_0.1W_100PPM; Case: 0603; Mounted: Yes; Sense: No; Socket: No; SMD: Yes; Manufacturer1 Example: NIC COMPONENT; Manufacturer1 ComponentHeight: 0.55mm; HelpURL: \\cern.ch\dfs\Applications\Altium\Datasheets\R0603_NIC_NRC.pdf; Author: CERN DEM JLC; CreateDate: 03/12/2007; LatestRevisionDate: 13/03/2008
R40 = R0603_2K_1%_0.1W_100PPM: Resistor - 1%; Part Description: General Purpose Thick Film Chip Resistor; Manufacturer: GENERIC; Manufacturer1 Part Number: NRC06F2001TRF; Power: 0.1W; TC: ±100ppm/°C; PressFit: No; Part Number: R0603_2K_1%_0.1W_100PPM; Component Kind: Standard; Component Type: Standard; Pin Count: 2; Value: 2k; Status: Preferred; Tolerance: ±1%; Manufacturer Part Number: R0603_2K_1%_0.1W_100PPM; Case: 0603; Mounted: Yes; Sense: No; Socket: No; SMD: Yes; Manufacturer1 Example: NIC COMPONENT; Manufacturer1 ComponentHeight: 0.55mm; HelpURL: \\cern.ch\dfs\Applications\Altium\Datasheets\R0603_NIC_NRC.pdf; Author: CERN DEM JLC; CreateDate: 03/12/2007; LatestRevisionDate: 13/03/2008
R41 R42 R47-R50 = R0603_0R_JUMPER: as R33 on sheet stabilizer_current_sense; Part Number: R0603_0R_JUMPER; Component Kind: Standard; Component Type: Standard; Pin Count: 2; Value: 0; Status: Preferred; Manufacturer Part Number: R0603_0R_JUMPER; Case: 0603; Mounted: Yes; Sense: No; Socket: No; SMD: Yes; Manufacturer1 Example: NIC COMPONENT; Manufacturer1 ComponentHeight: 0.55mm; HelpURL: \\cern.ch\dfs\Applications\Altium\Datasheets\R0603_NIC_NRC.pdf; Author: CERN DEM JLC; CreateDate: 03/12/2007; LatestRevisionDate: 13/03/2008
TP19-TP25 = SMD_PAD_1.27X1.27MM: as TP10 on sheet stabilizer_current_sense; Part Number: SMD_PAD_1.27X1.27MM; Component Kind: Standard (No BOM); Component Type: Standard (No BOM); Pin Count: 1; Family: Test Point; Socket: No; SMD: Yes; Sense: No; Status: None; ComponentHeight: 0mm; HelpURL: Undefined; Author: CERN DEM JLC; CreateDate: 12/01/2008; LatestRevisionDate: 12/01/2008; PackageDescription: 1.27mm x 1.27mm PCB Copper Area (SMD Test Point)

## Sheet mechanics.SchDoc: Mechanics
size A3; Organization: Ion Trapping Group; Address1: Department of Physics; Address2: University of Oxford; Address3: UK; DocumentNumber: 1; Revision: 1.0; SheetNumber: 5; SheetTotal: 5
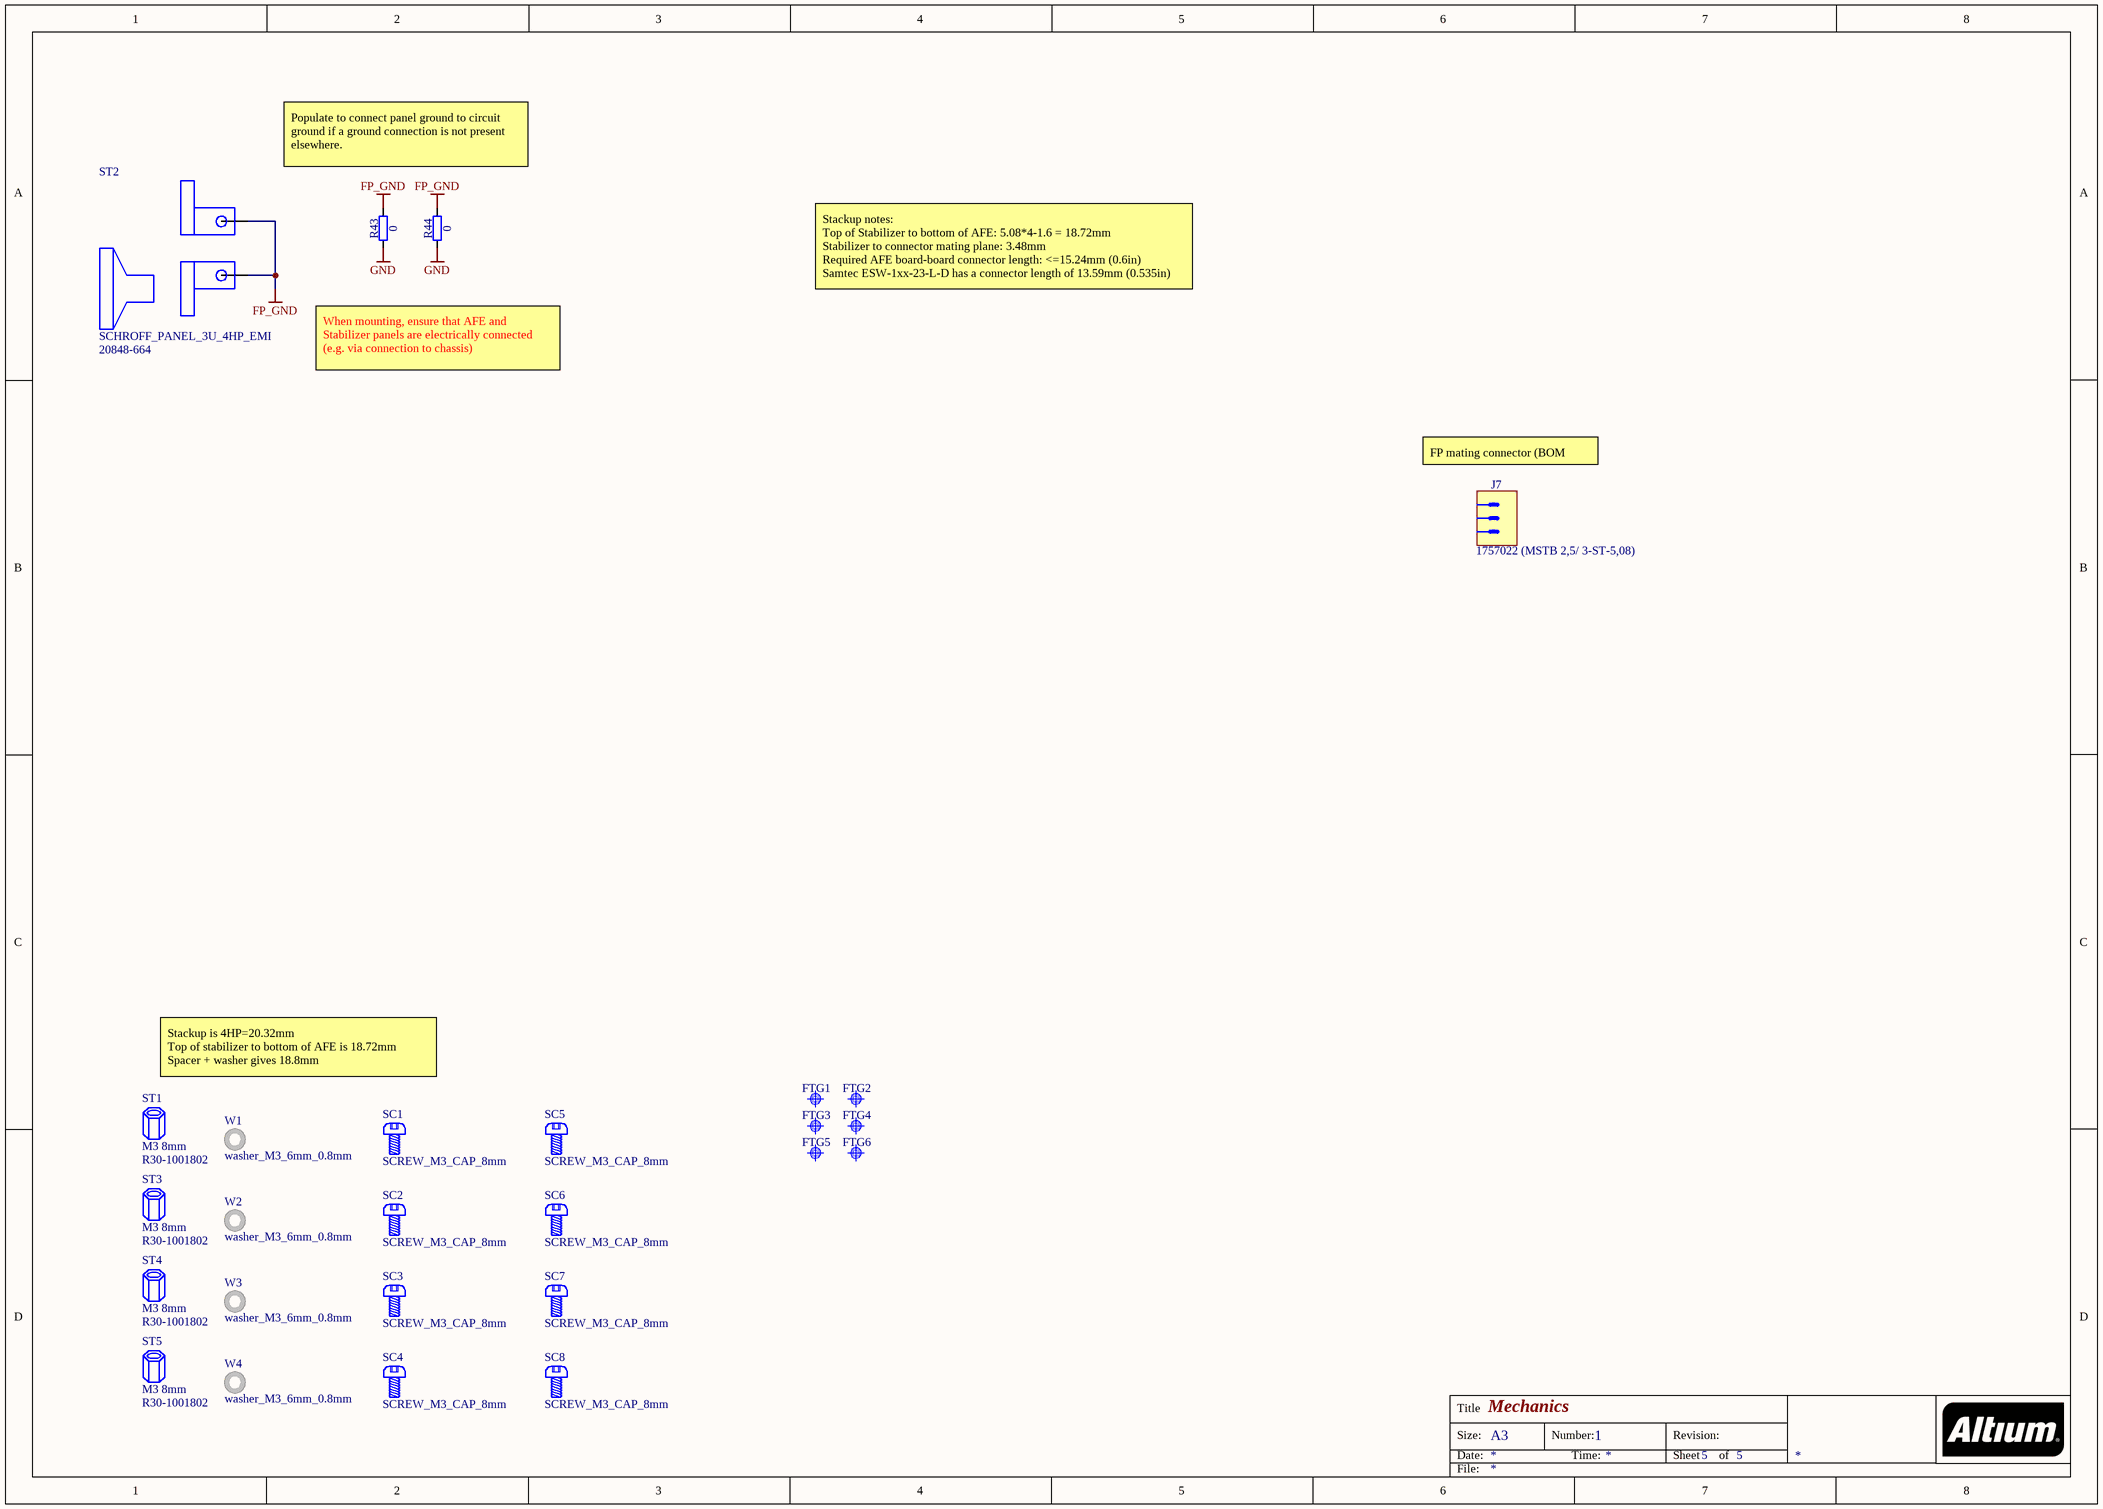
[diagram p2: mechanics.SchDoc]

### Parts
FTG1  Use only in PCB  [FIDUCIAL_TOP_C100-200]  (value not drawn)
FTG2  Use only in PCB  [FIDUCIAL_TOP_C100-200]  (value not drawn)
FTG3  Use only in PCB  [FIDUCIAL_TOP_C100-200]  (value not drawn)
FTG4  Use only in PCB  [FIDUCIAL_TOP_C100-200]  (value not drawn)
FTG5  Use only in PCB  [FIDUCIAL_TOP_C100-200]  (value not drawn)
FTG6  Use only in PCB  [FIDUCIAL_TOP_C100-200]  (value not drawn)
J7  Manufacturer Part Number: 1757022 (MSTB 2,5/ 3-ST-5,08)  [PHOENIX_1757022]
R43  0  [RESC1608X55N]
R44  0  [RESC1608X55N]
SC1  SCREW_M3_CAP_8mm  [SCREW_M3_CAP_8mm]
SC2  SCREW_M3_CAP_8mm  [SCREW_M3_CAP_8mm]
SC3  SCREW_M3_CAP_8mm  [SCREW_M3_CAP_8mm]
SC4  SCREW_M3_CAP_8mm  [SCREW_M3_CAP_8mm]
SC5  SCREW_M3_CAP_8mm  [SCREW_M3_CAP_8mm]
SC6  SCREW_M3_CAP_8mm  [SCREW_M3_CAP_8mm]
SC7  SCREW_M3_CAP_8mm  [SCREW_M3_CAP_8mm]
SC8  SCREW_M3_CAP_8mm  [SCREW_M3_CAP_8mm]
ST1  M3 8mm  [R30-1001802]
ST2  SCHROFF_PANEL_3U_4HP_EMI  Manufacturer Part Number: 20848-664  [SCHROFF_PANEL_3HP_4U]
ST3  M3 8mm  [R30-1001802]
ST4  M3 8mm  [R30-1001802]
ST5  M3 8mm  [R30-1001802]
W1  washer_M3_6mm_0.8mm  [washer_M3_6mm_0.8mm]
W2  washer_M3_6mm_0.8mm  [washer_M3_6mm_0.8mm]
W3  washer_M3_6mm_0.8mm  [washer_M3_6mm_0.8mm]
W4  washer_M3_6mm_0.8mm  [washer_M3_6mm_0.8mm]

### Nets
FP_GND: R43.2 R44.2 ST2.0 ST2.1
GND: R43.1 R44.1  [project net COIL_COMMON]

### Notes on the sheet
- Populate to connect panel ground to circuit ground if a ground connection is not present elsewhere.
- Stackup notes:
  Top of Stabilizer to bottom of AFE: 5.08*4-1.6 = 18.72mm
  Stabilizer to connector mating plane: 3.48mm
  Required AFE board-board connector length: <=15.24mm (0.6in)
  Samtec ESW-1xx-23-L-D has a connector length of 13.59mm (0.535in)
- When mounting, ensure that AFE and Stabilizer panels are electrically connected (e.g. via connection to chassis)
- (near J7) FP mating connector (BOM only)
- Stackup is 4HP=20.32mm
  Top of stabilizer to bottom of AFE is 18.72mm
  Spacer + washer gives 18.8mm
- Title
- Size:
- Date:
- A3
- Number:
- Time:
- Revision:
- Sheet
- of
- File:

### Library data of the parts
FTG1-FTG6 = FIDUCIAL_TARGET_C100-200: Fiducial Target; Part Description: Round Fiducial Target, Top Layer, 1.0mm, Top Solder 2.0mm, Keepout =2.0mm; Mounted: No; Part Number: FIDUCIAL_TARGET_C100-200; Component Kind: Standard (No BOM); Component Type: Standard (No BOM); Pin Count: 1; Family: Fiducial; Socket: No; SMD: Yes; Sense: No; Status: None; ComponentHeight: 0mm; HelpURL: Undefined; Author: CERN DEM JLC; CreateDate: 09/02/2010; LatestRevisionDate: 04/04/2012; PackageDescription: Round Fiducial Target, Top Layer, 1.0mm, Top Solder 2.0mm, Keepout =2.0mm
J7 = PHOENIX_1757022: Phoenix Contact 5.08mm pitch terminal plug, 3 ways; Mates with: 1757255 (MSTBA 2,5/ 3-G-5,08); Manufacturer: Phoenix Contact
R43 R44 = R0603_0R_JUMPER: as R33 on sheet stabilizer_current_sense; Part Number: R0603_0R_JUMPER; Component Kind: Standard; Component Type: Standard; Pin Count: 2; Value: 0; Status: Preferred; Manufacturer Part Number: R0603_0R_JUMPER; Case: 0603; Mounted: Yes; Sense: No; Socket: No; SMD: Yes; Manufacturer1 Example: NIC COMPONENT; Manufacturer1 ComponentHeight: 0.55mm; HelpURL: \\cern.ch\dfs\Applications\Altium\Datasheets\R0603_NIC_NRC.pdf; Author: CERN DEM JLC; CreateDate: 03/12/2007; LatestRevisionDate: 13/03/2008
SC1-SC8 = SCREW_M3_CAP_8mm: M3 x 8mm cap head screw; Manufacturer: Accu Limited; Manufacturer Part Number: SSCF-M3-8-12.9-Z
ST1 ST3-ST5 = STANDOFF_HARWIN_R30_1001802: M3.0x18 standoff; Manufacturer: Harwin; Manufacturer Part Number: R30-1001802
ST2 = SCHROFF_PANEL_3U_4HP_EMI: Schroff 3HP 4U EUROCARD Panel with EMI gaskets kit; Manufacturer: Schroff
W1-W4 = washer_M3_6mm_0.8mm: M3 Washer: / ID: 3.2mm / OD: 6mm / Thickness 0.8mm; Manufacturer: Accu Limited; Manufacturer Part Number: HAFZ-M3-A4

## Sheet frontend.SchDoc: Current Sense Frontend
size A3; Organization: Ion Trapping Group; Address1: Department of Physics; Address2: University of Oxford; Address3: UK; DocumentNumber: 1; Revision: 1.0; SheetNumber: 2; SheetTotal: 5
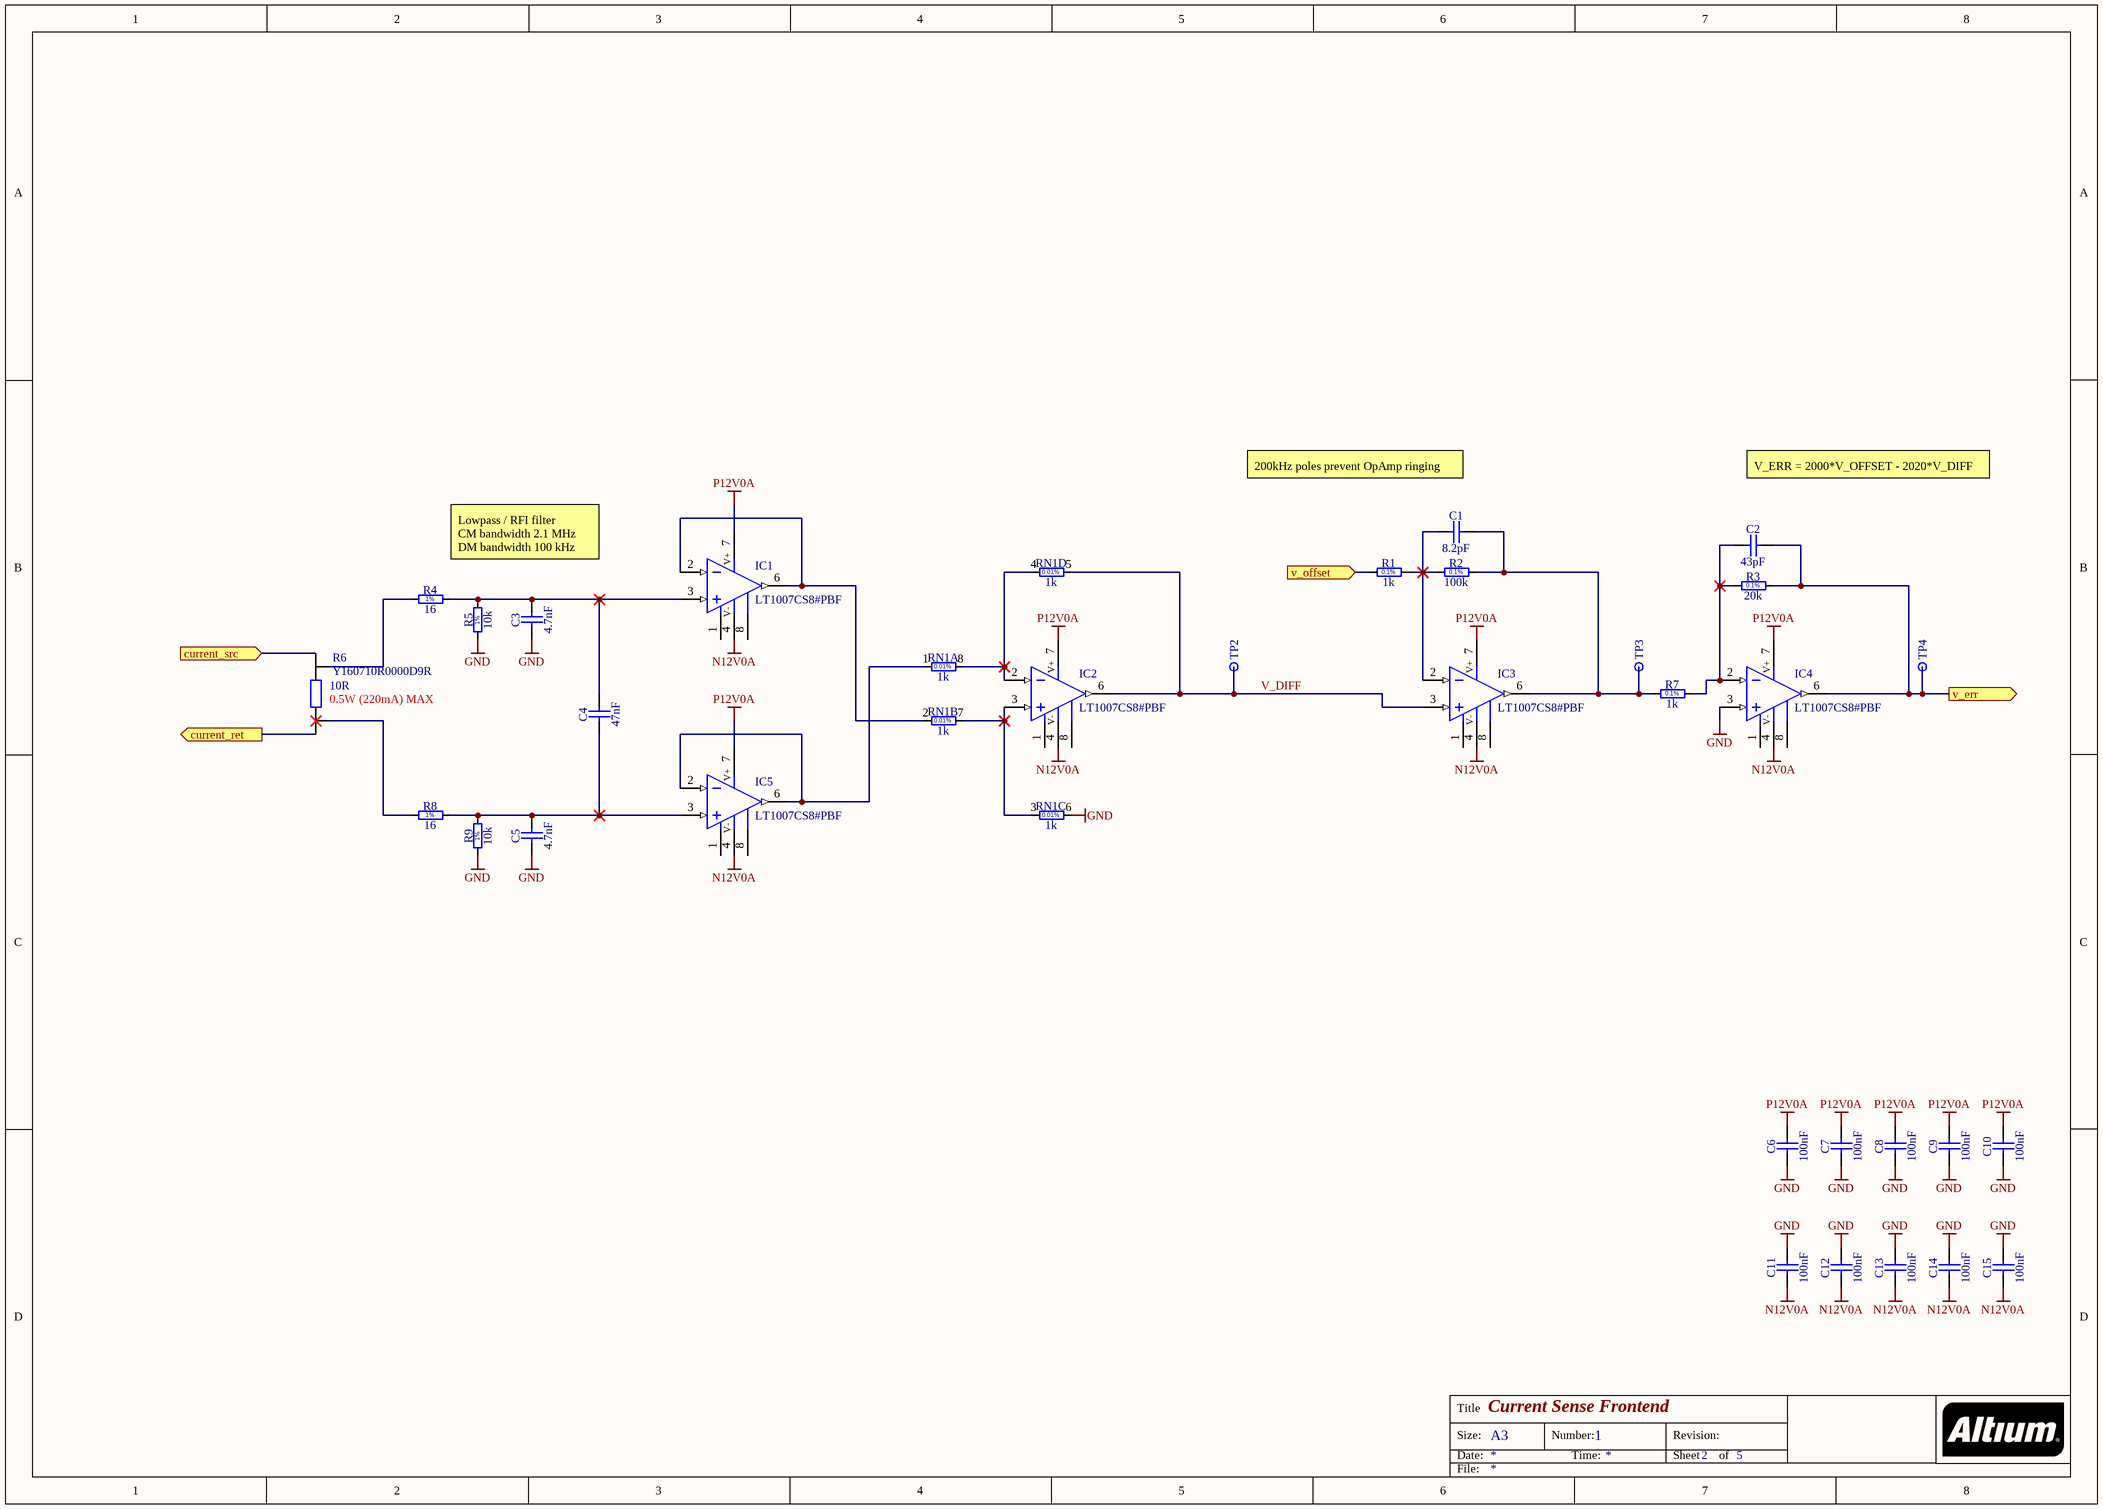
[diagram p3: frontend.SchDoc]

### Parts
C1  8.2pF  [CAPC1608X87N]
C2  43pF  [CAPC1608X87N]
C3  4.7nF  [CAPC2012X95N]
C4  47nF  [CAPC2012X135N]
C5  4.7nF  [CAPC2012X95N]
C6  100nF  [CAPC1608X87N]
C7  100nF  [CAPC1608X87N]
C8  100nF  [CAPC1608X87N]
C9  100nF  [CAPC1608X87N]
C10  100nF  [CAPC1608X87N]
C11  100nF  [CAPC1608X87N]
C12  100nF  [CAPC1608X87N]
C13  100nF  [CAPC1608X87N]
C14  100nF  [CAPC1608X87N]
C15  100nF  [CAPC1608X87N]
IC1  LT1007CS8#PBF  [SOIC127P600X175-8N]
IC2  LT1007CS8#PBF  [SOIC127P600X175-8N]
IC3  LT1007CS8#PBF  [SOIC127P600X175-8N]
IC4  LT1007CS8#PBF  [SOIC127P600X175-8N]
IC5  LT1007CS8#PBF  [SOIC127P600X175-8N]
R1  1k  [RESC1608X55N]
R2  100k  [RESC1608X55N]
R3  20k  [RESC1608X55N]
R4  16  [RESC1608X55N]
R5  10k  [RESC1608X55N]
R6  Y160710R0000D9R  [VCS1625Z]
R7  1k  [RESC1608X55N]
R8  16  [RESC1608X55N]
R9  10k  [RESC1608X55N]
RN1  1k  [SOP65P490X110-9N-R168X188]  (parts A,B,C,D of 4)
TP2  Test Point  [TPS127]  (value not drawn)
TP3  Test Point  [TPS127]  (value not drawn)
TP4  Test Point  [TPS127]  (value not drawn)

### Ports
current_ret (out), current_src (in), v_err (out), v_offset (in)

### Nets
GND: C3.1 C5.1 C6.1 C7.1 C8.1 C9.1 C10.1 C11.1 C12.1 C13.1 C14.1 C15.1 IC4.3(IN+) R5.1 R9.1 RN1.6 RN1.9(EP)  [project net COIL_COMMON]
N12V0A: C11.2 C12.2 C13.2 C14.2 C15.2 IC1.4(V-) IC2.4(V-) IC3.4(V-) IC4.4(V-) IC5.4(V-)
P12V0A: C6.2 C7.2 C8.2 C9.2 C10.2 IC1.7(V+) IC2.7(V+) IC3.7(V+) IC4.7(V+) IC5.7(V+)
ADC0_P: C2.2 IC4.6(OUT) R3.2 TP4.1 ; port v_err
FRONTEND_OFFSET: R1.1 ; port v_offset
transformer_Iret: R6.I1 ; port current_ret
transformer_Isource: R6.I2 ; port current_src
V_DIFF: IC2.6(OUT) IC3.3(IN+) RN1.5 TP2.1
NetC1_1: C1.1 IC3.2(IN-) R1.2 R2.1
NetC1_2: C1.2 IC3.6(OUT) R2.2 R7.1 TP3.1
NetC2_1: C2.1 IC4.2(IN-) R3.1 R7.2
NetC3_2: C3.2 C4.2 IC1.3(IN+) R4.2 R5.2
NetC4_1: C4.1 C5.2 IC5.3(IN+) R8.2 R9.2
NetIC1_2: IC1.2(IN-) IC1.6(OUT) RN1.2
NetIC2_2: IC2.2(IN-) RN1.4 RN1.8
NetIC2_3: IC2.3(IN+) RN1.3 RN1.7
NetIC5_2: IC5.2(IN-) IC5.6(OUT) RN1.1
NetR4_1: R4.1 R6.E2
NetR6_E1: R6.E1 R8.1

Not connected (* = marked no-connect by the designer): IC1 1(OFFSET) 8(OFFSET); IC2 1(OFFSET) 8(OFFSET); IC3 1(OFFSET) 8(OFFSET); IC4 1(OFFSET) 8(OFFSET); IC5 1(OFFSET) 8(OFFSET)

### Notes on the sheet
- 200kHz poles prevent OpAmp ringing
- V_ERR = 2000*V_OFFSET - 2020*V_DIFF
- Lowpass / RFI filter
  CM bandwidth 2.1 MHz
  DM bandwidth 100 kHz
- (near R6) 10R
- (near R6) 0.5W (220mA) MAX
- Title
- Size:
- Date:
- A3
- Number:
- Time:
- Revision:
- Sheet
- of
- File:
- (in symbol R0603_1K_0.1%_0.063W_10PPM) 0.1%
- (in symbol R0603_10K_1%_0.1W_100PPM) 1%
- (in symbol R0603_16R_1%_0.1W_100PPM) 1%
- (in symbol R0603_20K_0.1%_0.063W_10PPM) 0.1%
- (in symbol R0603_100K_0.1%_0.063W_10PPM) 0.1%

### Library data of the parts
C1 = CC0603_8.2PF_50V_0.5PF_NP0: Non-polarised capacitor; Part Description: SMD Multilayer Chip Ceramic Capacitor; Manufacturer: GENERIC; Manufacturer1 Part Number: 223886715828; Voltage: 50V; TC: C0G/NP0; Tolerance: ±0.5pF; Part Number: CC0603_8.2PF_50V_0.5PF_NP0; Component Kind: Standard; Component Type: Standard; Pin Count: 2; Value: 8.2pF; Status: Preferred; Manufacturer Part Number: CC0603_8.2PF_50V_0.5PF_NP0; Case: 0603; Mounted: Yes; Socket: No; SMD: Yes; Sense: No; Manufacturer1 Example: PHYCOMP; Manufacturer1 ComponentHeight: 0.87mm; HelpURL: \\cern.ch\dfs\Applications\Altium\Datasheets\CC0603_NP0_PHYCOMP.pdf; Author: CERN DEM JLC; CreateDate: 03/12/2007; LatestRevisionDate: 03/12/2007
C2 = CC0603_43PF_50V_5%_C0G: Non-polarised capacitor; Part Description: SMD Multilayer Chip Ceramic Capacitor; Manufacturer: GENERIC; Manufacturer1 Part Number: C0603C430J5GACTU; Voltage: 50V; TC: C0G/NP0; Tolerance: ±5%; Part Number: CC0603_43PF_50V_5%_C0G; Component Kind: Standard; Component Type: Standard; Pin Count: 2; Value: 43pF; Status: Preferred; Manufacturer Part Number: CC0603_43PF_50V_5%_C0G; Case: 0603; Mounted: Yes; Socket: No; SMD: Yes; Sense: No; Manufacturer1 Example: KEMET; Manufacturer1 ComponentHeight: 0.87mm; HelpURL: \\cern.ch\dfs\Applications\Altium\Datasheets\CC0603_C0G_KEMET_(Commercial Grade).pdf; Author: CERN DEM MR; CreateDate: 28/06/2017; LatestRevisionDate: 28/06/2017
C3 C5 = CC0805_4.7NF_50V_5%_NP0: Non-polarised capacitor; Part Description: SMD Multilayer Chip Ceramic Capacitor; Manufacturer: GENERIC; Manufacturer1 Part Number: GRM2195C1H472JA01; Voltage: 50V; TC: C0G/NP0; Tolerance: ±5%; Part Number: CC0805_4.7NF_50V_5%_NP0; Component Kind: Standard; Component Type: Standard; Pin Count: 2; Value: 4.7nF; Status: None; Manufacturer Part Number: CC0805_4.7NF_50V_5%_NP0; Case: 0805; Mounted: Yes; Socket: No; SMD: Yes; Sense: No; Manufacturer1 Example: MURATA; Manufacturer1 ComponentHeight: 0.95mm; HelpURL: \\cern.ch\dfs\Applications\Altium\Datasheets\CC0805_MURATA_GRM2195C1H472JA01.pdf; Author: CERN DEM MR; CreateDate: 30/03/2016; LatestRevisionDate: 30/03/2016
C4 = CC0805_47NF_25V_5%_C0G: Non-polarised capacitor; Part Description: SMD Multilayer Chip Ceramic Capacitor; Manufacturer: GENERIC; Manufacturer1 Part Number: C0805C473J3GACTU; Voltage: 25V; TC: C0G/NP0; Tolerance: ±5%; Part Number: CC0805_47NF_25V_5%_C0G; Component Kind: Standard; Component Type: Standard; Pin Count: 2; Value: 47nF; Status: None; Manufacturer Part Number: CC0805_47NF_25V_5%_C0G; Case: 0805; Mounted: Yes; Socket: No; SMD: Yes; Sense: No; Manufacturer1 Example: KEMET; Manufacturer1 ComponentHeight: 1.4mm; HelpURL: \\cern.ch\dfs\Applications\Altium\Datasheets\CC0805_C0G_KEMET_(Commercial Grade).pdf; Author: CERN DEM JLC; CreateDate: 18/01/2011; LatestRevisionDate: 18/01/2011
C6-C15 = CC0603_100NF_50V_10%_X7R: as C34 on sheet stabilizer_current_sense; Part Number: CC0603_100NF_50V_10%_X7R; Component Kind: Standard; Component Type: Standard; Pin Count: 2; Value: 100nF; Status: Preferred; Manufacturer Part Number: CC0603_100NF_50V_10%_X7R; Case: 0603; Mounted: Yes; Socket: No; SMD: Yes; Sense: No; Manufacturer1 Example: PHYCOMP; Manufacturer1 ComponentHeight: 0.87mm; HelpURL: \\cern.ch\dfs\Applications\Altium\Datasheets\CC0603_X7R_PHYCOMP.pdf; Author: CERN DEM JLC; CreateDate: 03/12/2007; LatestRevisionDate: 03/12/2007
IC1-IC5 = LT1007CS8#PBF: as IC10 on sheet stabilizer_current_sense; Part Number: LT1007CS8#PBF; Component Kind: Standard; Component Type: Standard; Device: LT1007CS8#PBF; PackageDescription: SOIC 8, Pitch 1.27mm - Body 4x5mm, IPC Medium Density; Manufacturer Part Number: LT1007CS8#PBF; Pin Count: 7; Case: SOIC8; Mounted: Yes; Socket: No; SMD: Yes; Sense: No; ComponentHeight: 1.75mm; Author: CERN DEM JLC; HelpURL: \\cern.ch\dfs\Applications\Altium\Datasheets\LT1007CS8#PBF.pdf; CreateDate: 09/03/2011; LatestRevisionDate: 09/03/2011
R1 R7 = R0603_1K_0.1%_0.063W_10PPM: Resistor - 0.1%; Part Description: Thin Film Chip Resistor; Manufacturer: GENERIC; Manufacturer1 Part Number: RN73C1J1K0BTG; Power: 0.063W; TC: ±10ppm; PressFit: No; Part Number: R0603_1K_0.1%_0.063W_10PPM; Component Kind: Standard; Component Type: Standard; Pin Count: 2; Value: 1k; Status: Not Recommended; Tolerance: ±0.1%; Manufacturer Part Number: R0603_1K_0.1%_0.063W_10PPM; Case: 0603; Mounted: Yes; Sense: No; Socket: No; SMD: Yes; Manufacturer1 Example: TYCO HOLSWORTHY; Manufacturer1 ComponentHeight: 0.55mm; HelpURL: \\cern.ch\dfs\Applications\Altium\Datasheets\R0603_Tyco_RN73.pdf; Author: CERN DEM BC; CreateDate: 23/05/2016; LatestRevisionDate: 23/05/2016
R2 = R0603_100K_0.1%_0.063W_10PPM: Resistor - 0.1%; Part Description: Thin Film Chip Resistor; Manufacturer: GENERIC; Manufacturer1 Part Number: RN73C1J100KBTDF; Power: 0.063W; TC: ±10ppm; PressFit: No; Part Number: R0603_100K_0.1%_0.063W_10PPM; Component Kind: Standard; Component Type: Standard; Pin Count: 2; Value: 100k; Status: Not Recommended; Tolerance: ±0.1%; Manufacturer Part Number: R0603_100K_0.1%_0.063W_10PPM; Case: 0603; Mounted: Yes; Sense: No; Socket: No; SMD: Yes; Manufacturer1 Example: TYCO HOLSWORTHY; Manufacturer1 ComponentHeight: 0.55mm; HelpURL: \\cern.ch\dfs\Applications\Altium\Datasheets\R0603_Tyco_RN73.pdf; Author: CERN DEM JLC; CreateDate: 03/12/2007; LatestRevisionDate: 13/03/2008
R3 = R0603_20K_0.1%_0.063W_10PPM: Resistor - 0.1%; Part Description: Thin Film Chip Resistor; Manufacturer: GENERIC; Manufacturer1 Part Number: RN73C1J20KBTDF; Power: 0.063W; TC: ±10ppm; PressFit: No; Part Number: R0603_20K_0.1%_0.063W_10PPM; Component Kind: Standard; Component Type: Standard; Pin Count: 2; Value: 20k; Status: Not Recommended; Tolerance: ±0.1%; Manufacturer Part Number: R0603_20K_0.1%_0.063W_10PPM; Case: 0603; Mounted: Yes; Sense: No; Socket: No; SMD: Yes; Manufacturer1 Example: TYCO HOLSWORTHY; Manufacturer1 ComponentHeight: 0.5mm; HelpURL: \\cern.ch\dfs\Applications\Altium\Datasheets\R0603_Tyco_RN73.pdf; Author: CERN DEM JLC; CreateDate: 03/12/2007; LatestRevisionDate: 13/03/2008
R4 R8 = R0603_16R_1%_0.1W_100PPM: Resistor - 1%; Part Description: General Purpose Thick Film Chip Resistor; Manufacturer: GENERIC; Manufacturer1 Part Number: NRC06F16R0TRF; Power: 0.1W; TC: ±100ppm/°C; PressFit: No; Part Number: R0603_16R_1%_0.1W_100PPM; Component Kind: Standard; Component Type: Standard; Pin Count: 2; Value: 16; Status: Preferred; Tolerance: ±1%; Manufacturer Part Number: R0603_16R_1%_0.1W_100PPM; Case: 0603; Mounted: Yes; Sense: No; Socket: No; SMD: Yes; Manufacturer1 Example: NIC COMPONENT; Manufacturer1 ComponentHeight: 0.55mm; HelpURL: \\cern.ch\dfs\Applications\Altium\Datasheets\R0603_NIC_NRC.pdf; Author: CERN DEM JLC; CreateDate: 03/12/2007; LatestRevisionDate: 13/03/2008
R5 R9 = R0603_10K_1%_0.1W_100PPM: Resistor - 1%; Part Description: General Purpose Thick Film Chip Resistor; Manufacturer: GENERIC; Manufacturer1 Part Number: NRC06F1002TRF; Power: 0.1W; TC: ±100ppm/°C; PressFit: No; Part Number: R0603_10K_1%_0.1W_100PPM; Component Kind: Standard; Component Type: Standard; Pin Count: 2; Value: 10k; Status: Preferred; Tolerance: ±1%; Manufacturer Part Number: R0603_10K_1%_0.1W_100PPM; Case: 0603; Mounted: Yes; Sense: No; Socket: No; SMD: Yes; Manufacturer1 Example: NIC COMPONENT; Manufacturer1 ComponentHeight: 0.55mm; HelpURL: \\cern.ch\dfs\Applications\Altium\Datasheets\R0603_NIC_NRC.pdf; Author: CERN DEM JLC; CreateDate: 03/12/2007; LatestRevisionDate: 13/03/2008
R6 = Y160710R0000D9R: Current sense resistor, 10 Ohm, 500 mW, +-0.5%, 0.05ppm; Manufacturer: Vishay Foil Resistors; Supplier 1: Digi-Key; Device: Y160710R0000D9R; Manufacturer Part Number: Y160710R0000D9R
RN1 = RN_1K_1K_LINEAR_LT5400ACMS8E-4#PBF: DIL8 Resistor Network 4 Isolated Resistor 0.01% + Exposed Pad; Part Description: Quad Matched Resistor Network, Temperature Range  0°C to 70°C, LT5400 Series; Manufacturer: LINEAR TECHNOLOGY; Power: 4x0.8W; TC: ±0.2ppm/°C; PressFit: No; Part Number: RN_1K_1K_LINEAR_LT5400ACMS8E-4#PBF; Component Kind: Standard; Component Type: Standard; Pin Count: 9; Value: 1k; Sense: No; Tolerance: 0.01%; Manufacturer Part Number: LT5400ACMS8E-4#PBF; Case: MSOP8; Mounted: Yes; Socket: No; SMD: Yes; ComponentHeight: 1.1mm; HelpURL: \\cern.ch\dfs\Applications\Altium\Datasheets\RN_LINEAR_LT5400.pdf; Author: CERN DEM MR; CreateDate: 22/02/2016; LatestRevisionDate: 26/02/2018
TP2-TP4 = SMD_PAD_1.27X1.27MM: as TP10 on sheet stabilizer_current_sense; Part Number: SMD_PAD_1.27X1.27MM; Component Kind: Standard (No BOM); Component Type: Standard (No BOM); Pin Count: 1; Family: Test Point; Socket: No; SMD: Yes; Sense: No; Status: None; ComponentHeight: 0mm; HelpURL: Undefined; Author: CERN DEM JLC; CreateDate: 12/01/2008; LatestRevisionDate: 12/01/2008; PackageDescription: 1.27mm x 1.27mm PCB Copper Area (SMD Test Point)